# EasyEDA schematic 1-Schematic_example_main.json
TITLE: Sheet_1; REV: 1.0; Date: 2020-04-26; Sheet: 1/1; Drawn By: elvisfox; Company: Your Company
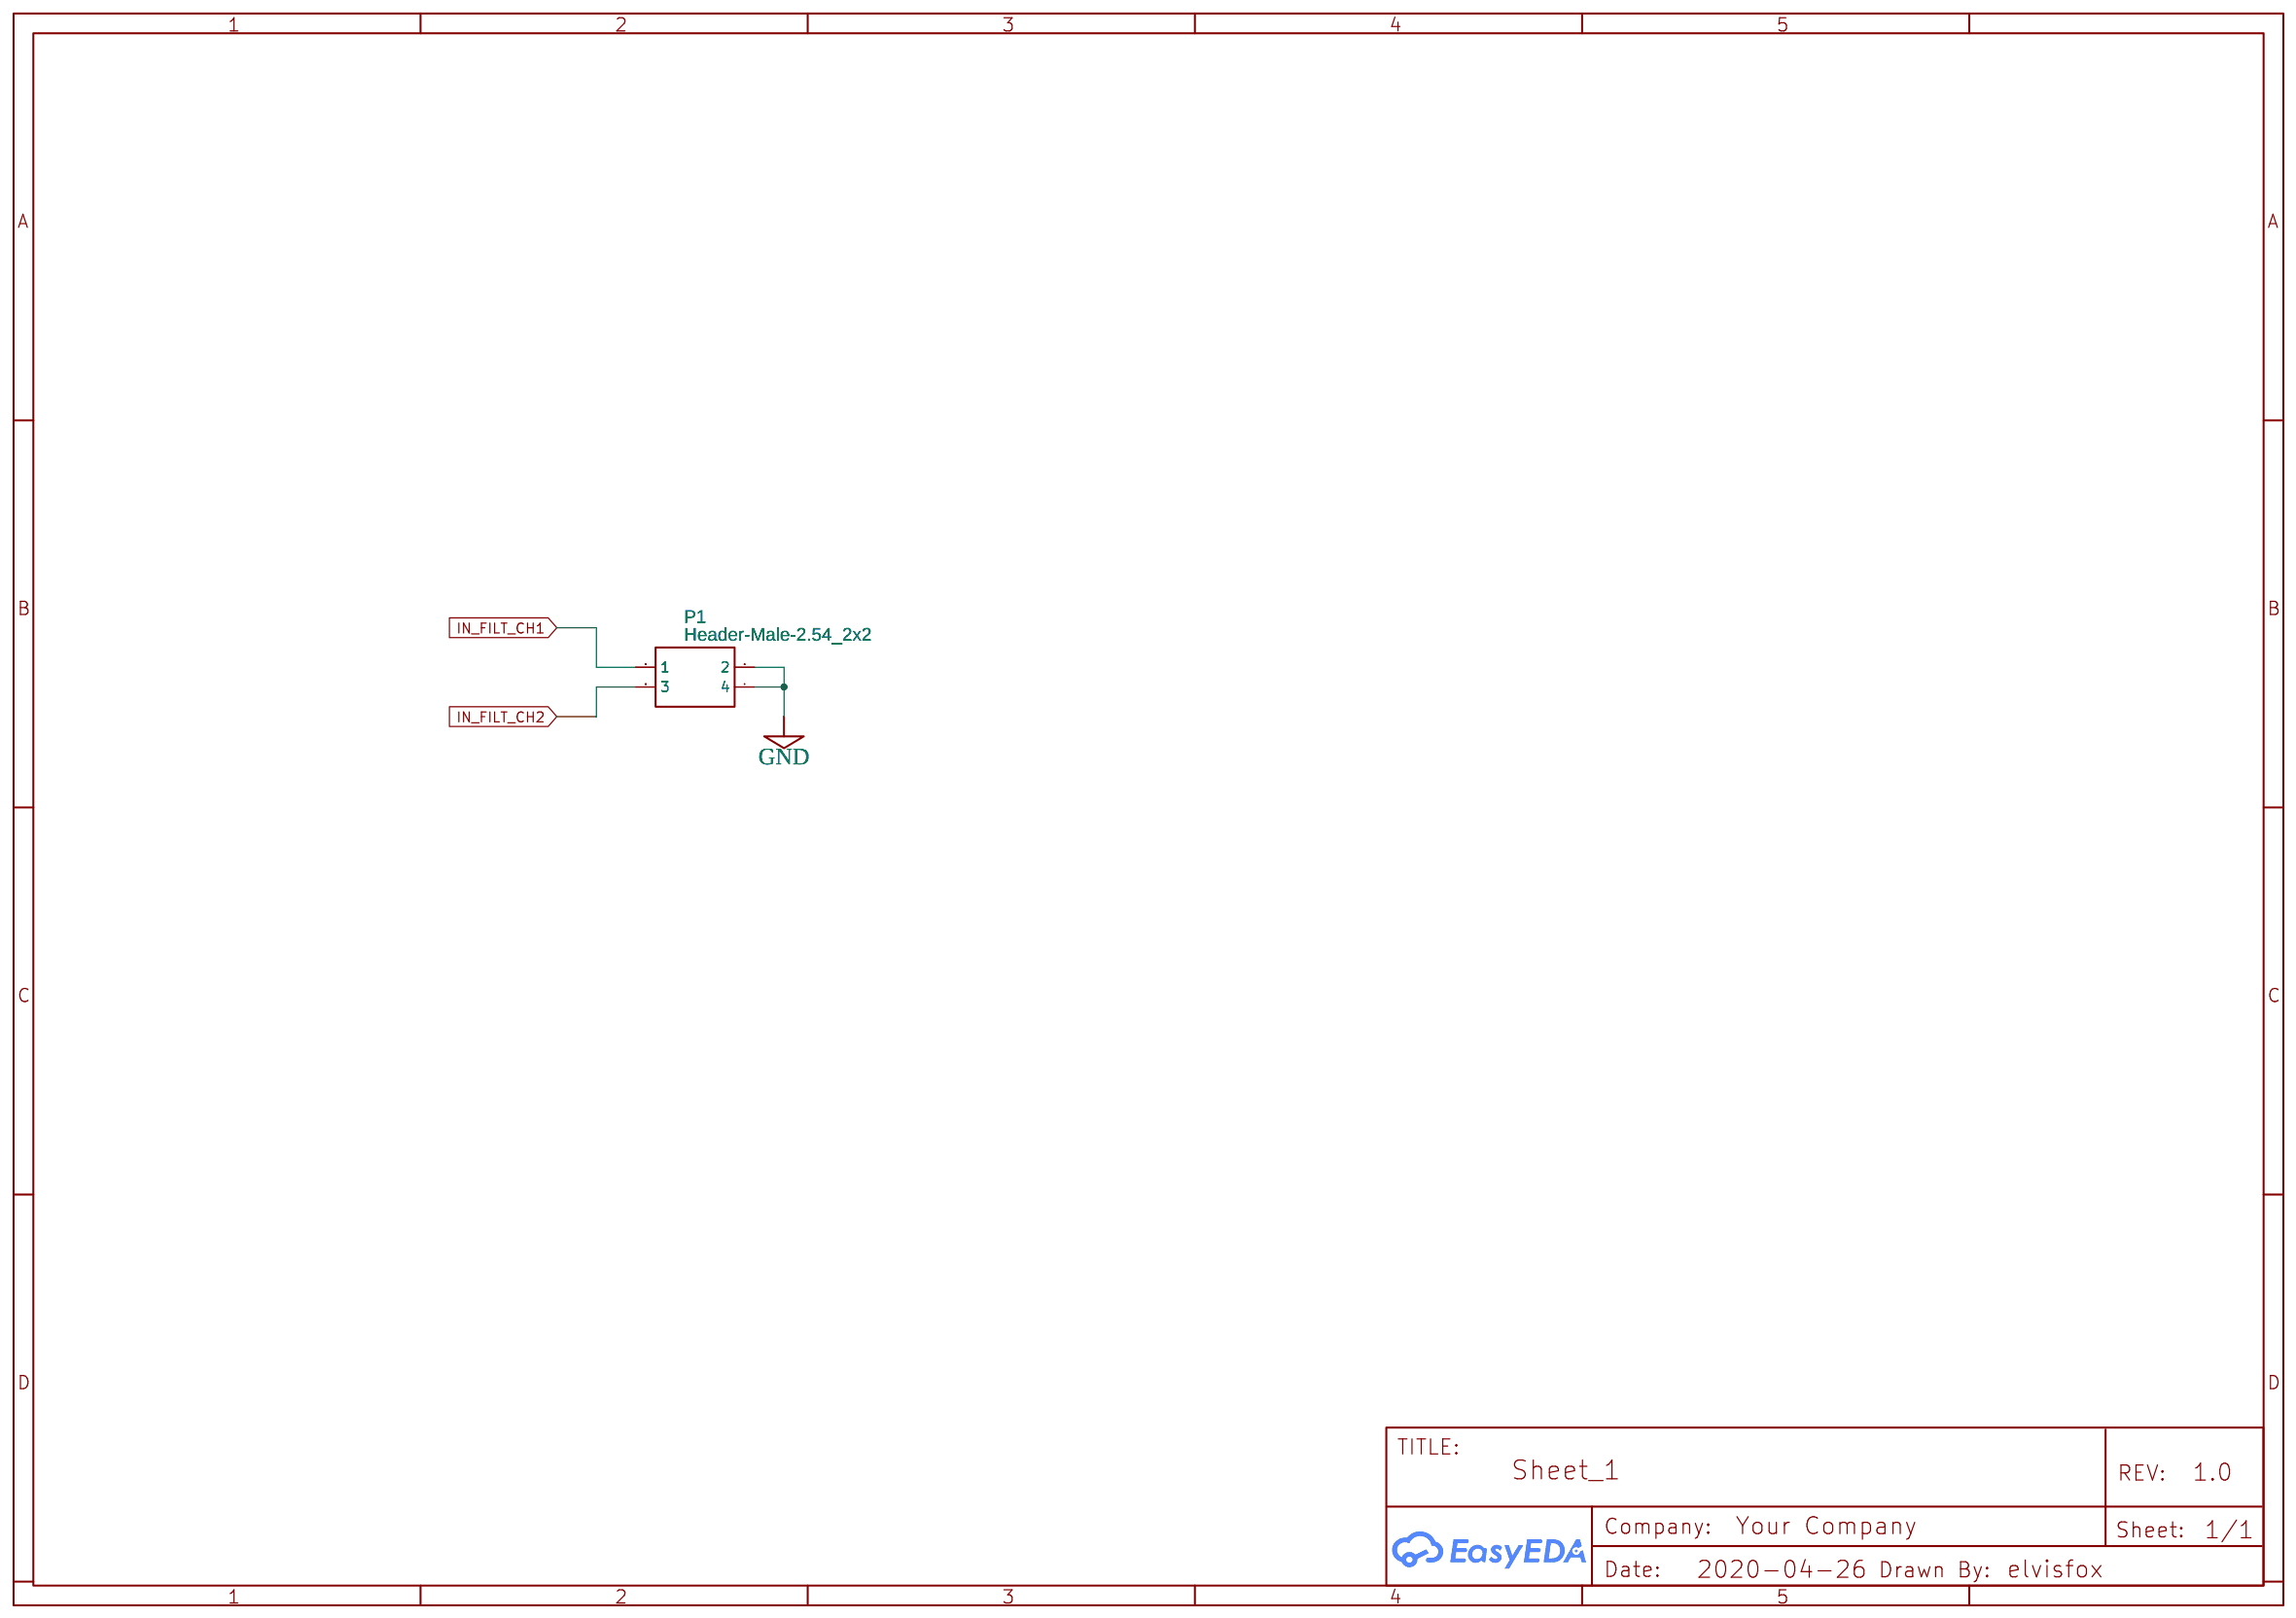
[diagram p0: schematic sheet]

## Parts
P1  Header-Male-2.54_2x2  [HDR-TH_4P-P2.54-V-R2-C2-S2.54]

## Library data of the parts
P1 = Header-Male-2.54_2x2: Supplier: LCSC; Manufacturer: BOOMELE; Manufacturer Part: Double Rows2.54mm2*2pHeaders  Pins; Supplier Part: C66690

## Nets
GND: P1.2 P1.4
IN_FILT_CH1: P1.1
IN_FILT_CH2: P1.3
